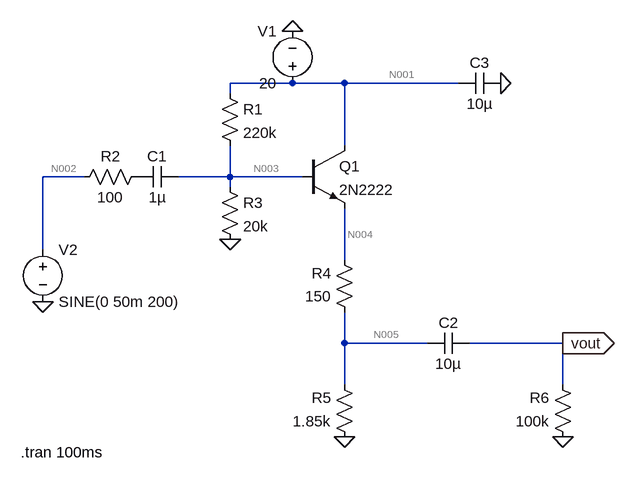
[diagram p0: schematic Draft1.asc]
Draft1.asc, the LTspice schematic file:
Version 4
SHEET 1 880 680
WIRE 192 64 96 64
WIRE 272 64 192 64
WIRE 448 64 272 64
WIRE 96 80 96 64
WIRE 272 160 272 64
WIRE -128 208 -192 208
WIRE 96 208 96 160
WIRE 96 208 16 208
WIRE 208 208 96 208
WIRE 96 224 96 208
WIRE -192 320 -192 208
WIRE 272 336 272 256
WIRE 272 464 272 416
WIRE 400 464 272 464
WIRE 608 464 464 464
WIRE 272 528 272 464
WIRE 608 528 608 464
FLAG 272 608 0
FLAG 608 608 0
FLAG 192 -16 0
FLAG -192 400 0
FLAG 512 64 0
FLAG 608 464 vout
IOPIN 608 464 Out
FLAG 96 304 0
SYMBOL res 80 64 R0
SYMATTR InstName R1
SYMATTR Value 220k
SYMBOL voltage 192 80 R180
WINDOW 0 24 96 Left 2
WINDOW 3 24 16 Left 2
WINDOW 123 0 0 Left 0
WINDOW 39 0 0 Left 0
SYMATTR InstName V1
SYMATTR Value 20
SYMBOL cap 16 192 R90
WINDOW 0 0 32 VBottom 2
WINDOW 3 32 32 VTop 2
SYMATTR InstName C1
SYMATTR Value 1µ
SYMBOL cap 464 448 R90
WINDOW 0 0 32 VBottom 2
WINDOW 3 32 32 VTop 2
SYMATTR InstName C2
SYMATTR Value 10µ
SYMBOL res -32 192 R90
WINDOW 0 0 56 VBottom 2
WINDOW 3 32 56 VTop 2
SYMATTR InstName R2
SYMATTR Value 100
SYMBOL res 288 432 R180
WINDOW 0 36 76 Left 2
WINDOW 3 36 40 Left 2
SYMATTR InstName R4
SYMATTR Value 150
SYMBOL res 288 624 R180
WINDOW 0 36 76 Left 2
WINDOW 3 36 40 Left 2
SYMATTR InstName R5
SYMATTR Value 1.85k
SYMBOL res 624 624 R180
WINDOW 0 36 76 Left 2
WINDOW 3 36 40 Left 2
SYMATTR InstName R6
SYMATTR Value 100k
SYMBOL voltage -192 304 R0
WINDOW 123 0 0 Left 0
WINDOW 39 0 0 Left 0
SYMATTR InstName V2
SYMATTR Value SINE(0 50m 200)
SYMBOL cap 512 48 R90
WINDOW 0 0 32 VBottom 2
WINDOW 3 32 32 VTop 2
SYMATTR InstName C3
SYMATTR Value 10µ
SYMBOL npn 208 160 R0
SYMATTR InstName Q1
SYMATTR Value 2N2222
SYMBOL res 80 208 R0
SYMATTR InstName R3
SYMATTR Value 20k
TEXT -226 632 Left 2 !.tran 100ms

The netlist it stands for:
* Draft1.asc
R1 N001 N003 220k
V1 N001 0 20
C1 N003 P001 1µ
C2 vout N005 10µ
R2 P001 N002 100
R4 N005 N004 150
R5 0 N005 1.85k
R6 0 vout 100k
V2 N002 0 SINE(0 50m 200)
C3 0 N001 10µ
Q1 N001 N003 N004 0 2N2222
R3 N003 0 20k
.model NPN NPN
.model PNP PNP
.lib standard.bjt
.tran 100ms
.backanno
.end

* Results of the author's LTspice run, read from the files saved beside the schematic
* Operating Point, zero values left out:
*   V(n001) = 20 V
*   V(n003) = 1.628 V
*   V(n005) = 920.8 mV
*   V(n004) = 995.5 mV
*   Ic(Q1) = 495.6 µA
*   Ib(Q1) = 2.096 µA
*   Ie(Q1) = -497.7 µA
*   I(R3) = 81.41 µA
*   I(R5) = -497.7 µA
*   I(R4) = -497.7 µA
*   I(R1) = 83.51 µA
*   I(V1) = -579.1 µA
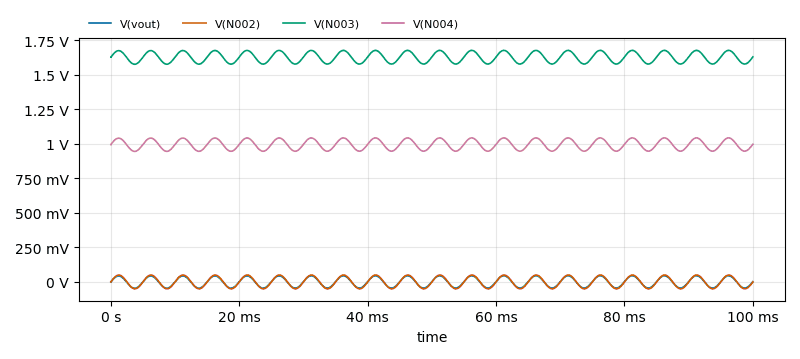
[diagram p1: Transient Analysis of Draft1.asc, plotted from the saved traces]
* Transient Analysis, 1 run:
*   V(vout): min -46.16 mV, max 44.57 mV, average -337.6 µV, rms 31.47 mV, last 2.034 mV
*   V(N002): min -49.88 mV, max 49.88 mV, average -170.2 nV, rms 35.24 mV, last 0 V
*   V(N003): min 1.577 V, max 1.678 V, average 1.628 V, rms 1.628 V, last 1.63 V
*   V(N004): min 945.5 mV, max 1.044 V, average 995.1 mV, rms 995.7 mV, last 997.6 mV